# EasyEDA Pro project FOC第一版-DRV8301.epro

# Schematic Schematic1
Board Name: Board1; Create Date: 2025-05-15; Page Name: P1; Project Name: FOC三相-DRV8301; Schematic Name: Schematic1; Update Date: 2025-05-19; BladeWidth: 10; Company: 嘉立创EDA; Page Size: A3; RegionStart: 1; ShowBorder: 1; TitleBlock: 1; TitleBlockPosition: 3; Version: V1.0; XRegionCount: 6; YRegionCount: 4
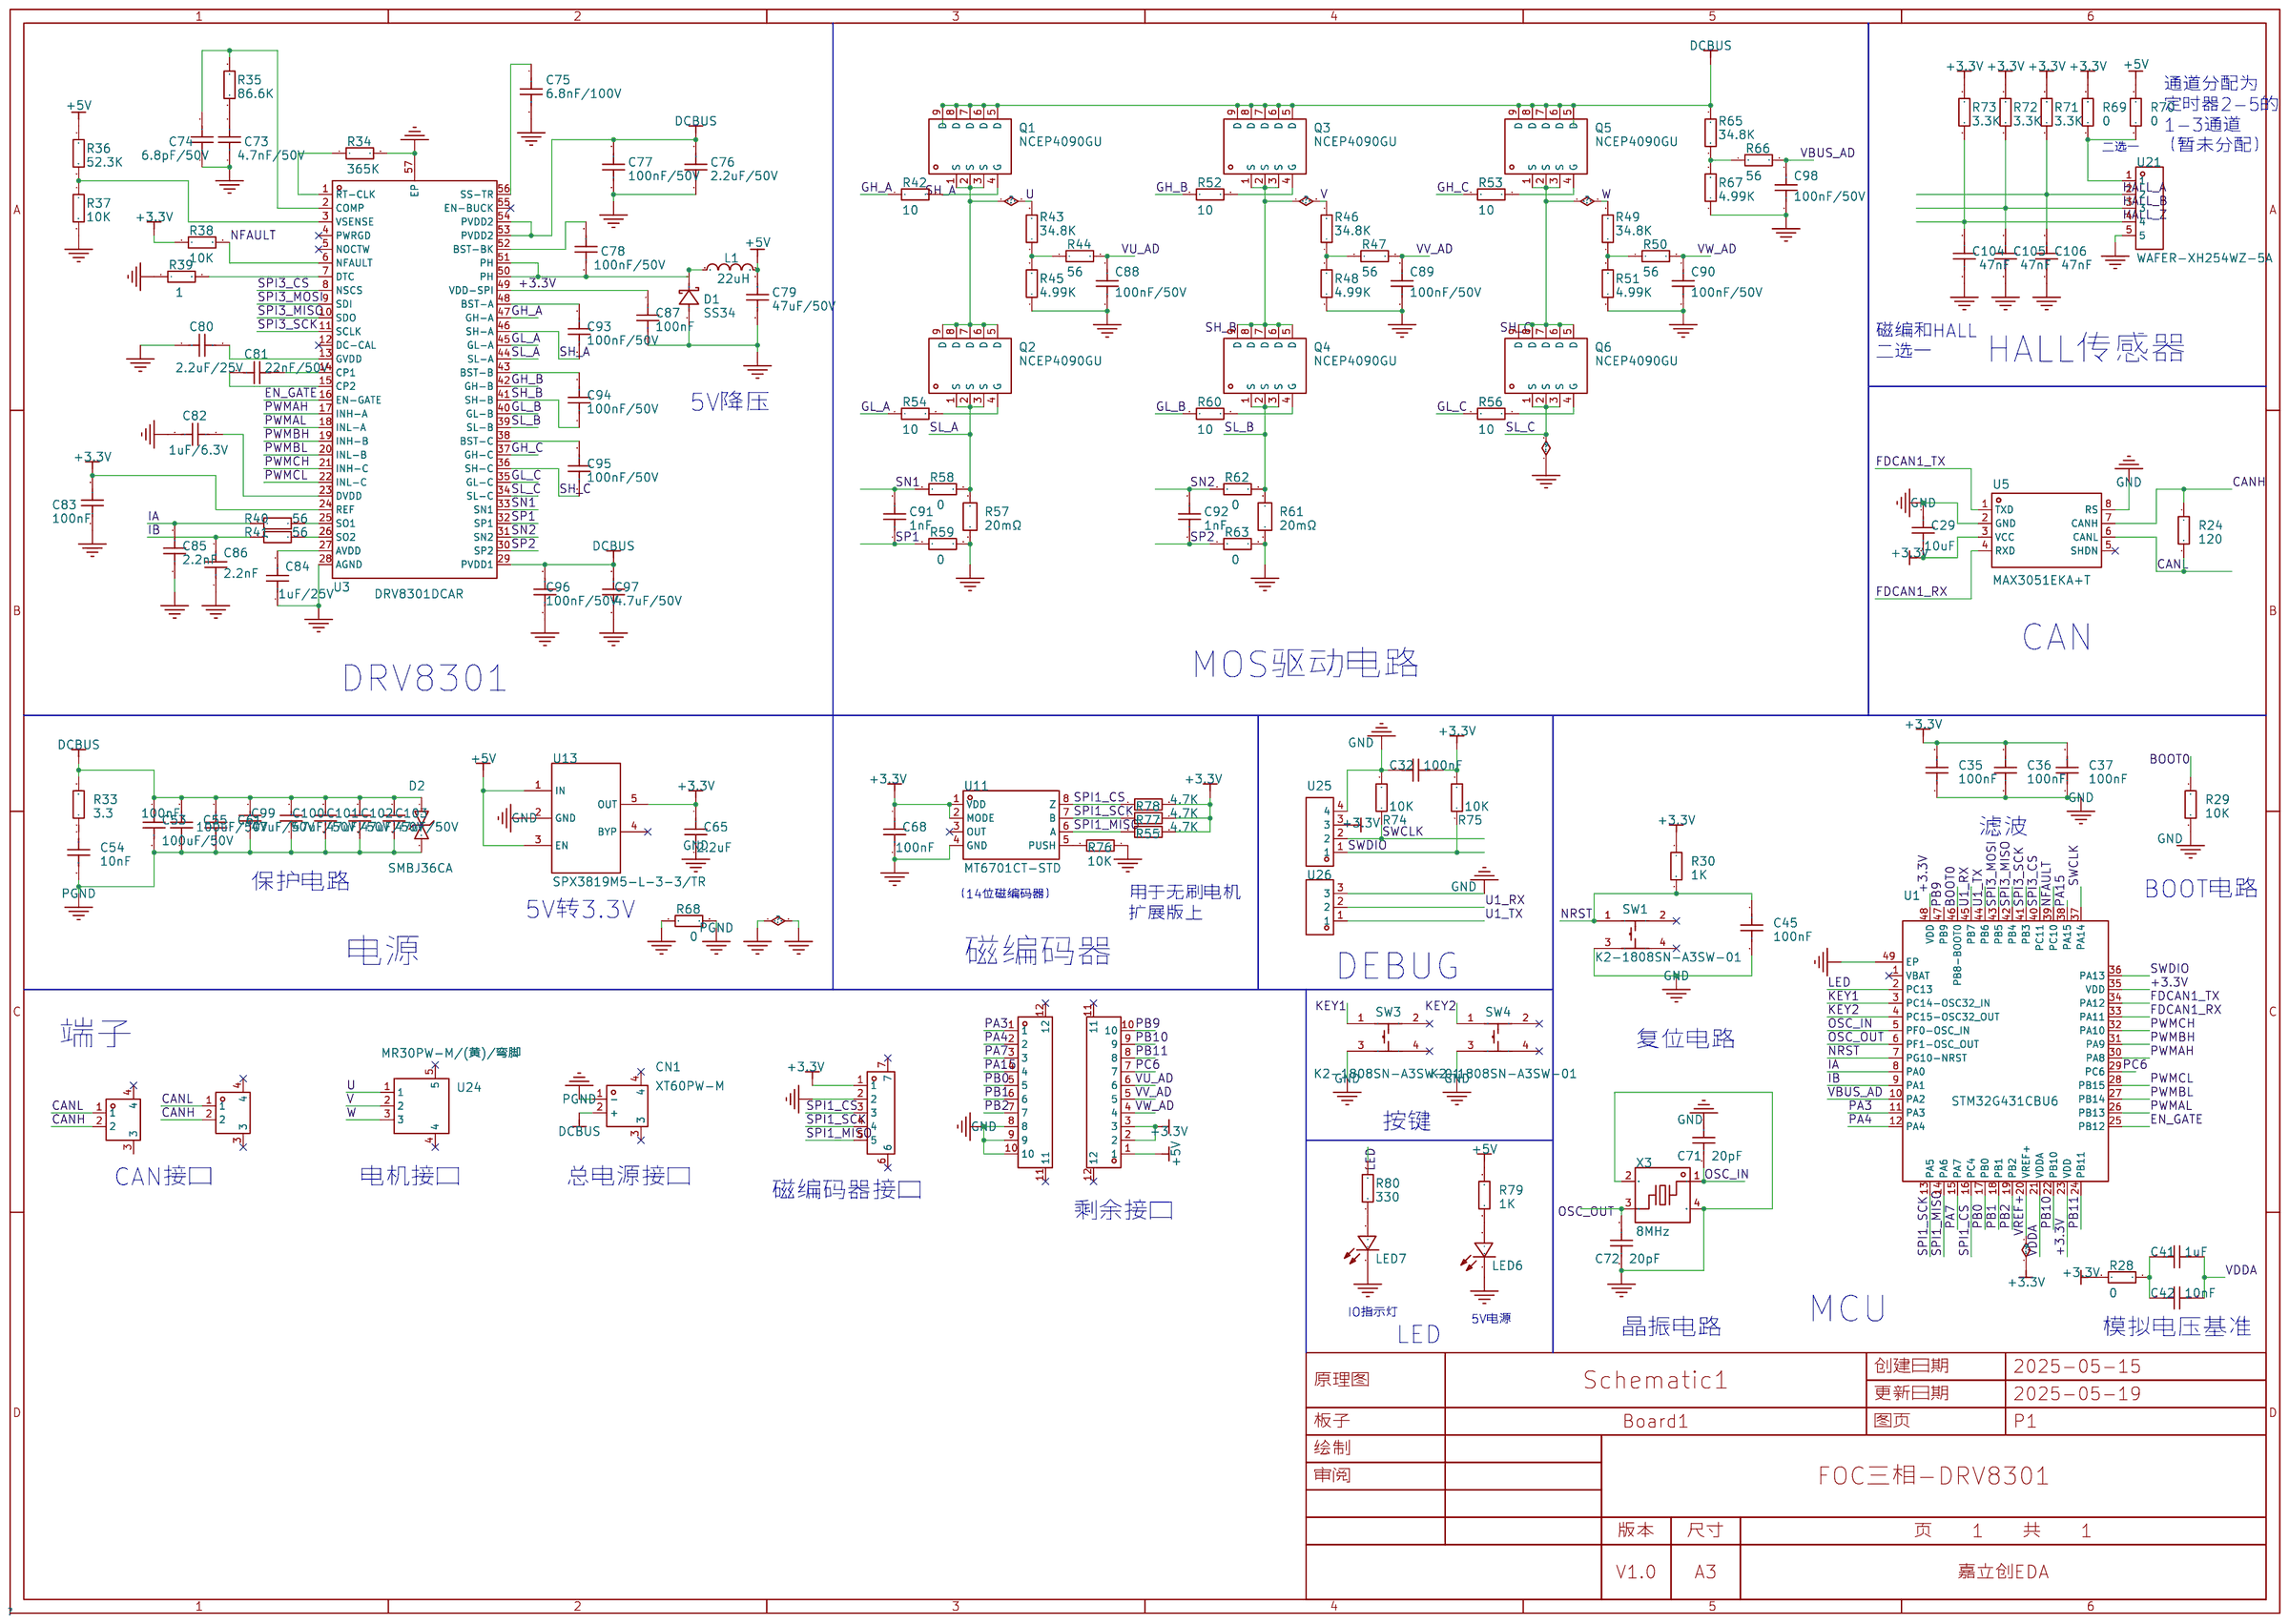
[diagram p0: schematic sheet]

## Parts
C29  10uF  [C0603]
C32  100nF  [C0603]
C35  100nF  [C0603]
C36  100nF  [C0603]
C37  100nF  [C0603]
C41  1uF  [C0603]
C42  10nF  [C0603]
C45  100nF  [C0603]
C53  100nF  [C0603]
C54  10nF  [C0603]
C55  100uF/50V  [C1206]
C61  100uF/50V  [C1206]
C65  2.2uF  [C0603]
C68  100nF  [C0603]
C71  20pF  [C0603]
C72  20pF  [C0603]
C73  4.7nF/50V  [C0603]
C74  6.8pF/50V  [C0603]
C75  6.8nF/100V  [C0603]
C76  2.2uF/50V  [C0603]
C77  100nF/50V  [C0603]
C78  100nF/50V  [C0603]
C79  47uF/50V  [C1812]
C80  2.2uF/25V  [C0603]
C81  22nF/50V  [C0603]
C82  1uF/6.3V  [C0603]
C83  100nF  [C0603]
C84  1uF/25V  [C0603]
C85  2.2nF  [C0603]
C86  2.2nF  [C0603]
C87  100nF  [C0603]
C88  100nF/50V  [C0603]
C89  100nF/50V  [C0603]
C90  100nF/50V  [C0603]
C91  1nF  [C0603]
C92  1nF  [C0603]
C93  100nF/50V  [C0603]
C94  100nF/50V  [C0603]
C95  100nF/50V  [C0603]
C96  100nF/50V  [C0603]
C97  4.7uF/50V  [C0603]
C98  100nF/50V  [C0603]
C99  47uF/50V  [C1812]
C100  47uF/50V  [C1812]
C101  47uF/50V  [C1812]
C102  47uF/50V  [C1812]
C103  47uF/50V  [C1812]
C104  47nF  [C0603]
C105  47nF  [C0603]
C106  47nF  [C0603]
CN1  XT60PW-M  [CONN-TH_XT60PW-M]
CN2  X9821WRS-02-9TSN  [CONN-SMD_2P-P1.25_X9821WRS-02-9TSN]
CN3  X9821WRS-02-9TSN  [CONN-SMD_2P-P1.25_X9821WRS-02-9TSN]
CN4  X9821WRS-05-9TSN  [CONN-SMD_5P-P1.25_X9821WRS-05-9TSN]
CN7  X9821WRS-10-9TSN  [CONN-SMD_10P-P1.25_X9821WRS-10-9TSN]
CN8  X9821WRS-10-9TSN  [CONN-SMD_10P-P1.25_X9821WRS-10-9TSN]
D1  SS34  [SMA_L4.3-W2.5-LS5.0-RD]
D2  SMBJ36CA  [SMB_L4.4-W3.6-LS5.3-BI]
L1  22uH  [IND-SMD_L7.0-W6.6_FXL0630]
LED6  KT-0603R  [LED0603-RD]
LED7  KT-0603R  [LED0603-RD]
Q1  NCEP4090GU  [PDFN-8_L5.8-W5.1-P1.27-LS6.1-BL]
Q2  NCEP4090GU  [PDFN-8_L5.8-W5.1-P1.27-LS6.1-BL]
Q3  NCEP4090GU  [PDFN-8_L5.8-W5.1-P1.27-LS6.1-BL]
Q4  NCEP4090GU  [PDFN-8_L5.8-W5.1-P1.27-LS6.1-BL]
Q5  NCEP4090GU  [PDFN-8_L5.8-W5.1-P1.27-LS6.1-BL]
Q6  NCEP4090GU  [PDFN-8_L5.8-W5.1-P1.27-LS6.1-BL]
R24  120  [R0603]
R28  0  [R0603]
R29  10K  [R0603]
R30  1K  [R0603]
R33  3.3  [R0603]
R34  365K  [R0603]
R35  86.6K  [R0603]
R36  52.3K  [R0603]
R37  10K  [R0603]
R38  10K  [R0603]
R39  1  [R0603]
R40  56  [R0603]
R41  56  [R0603]
R42  10  [R0603]
R43  34.8K  [R0603]
R44  56  [R0603]
R45  4.99K  [R0603]
R46  34.8K  [R0603]
R47  56  [R0603]
R48  4.99K  [R0603]
R49  34.8K  [R0603]
R50  56  [R0603]
R51  4.99K  [R0603]
R52  10  [R0603]
R53  10  [R0603]
R54  10  [R0603]
R55  4.7K  [R0603]
R56  10  [R0603]
R57  20mΩ  [RES-SMD_L6.4-W3.2-1]
R58  0  [R0603]
R59  0  [R0603]
R60  10  [R0603]
R61  20mΩ  [RES-SMD_L6.4-W3.2-1]
R62  0  [R0603]
R63  0  [R0603]
R65  34.8K  [R0603]
R66  56  [R0603]
R67  4.99K  [R0603]
R68  0  [R0603]
R69  0  [R0603]
R70  0  [R0603]
R71  3.3K  [R0603]
R72  3.3K  [R0603]
R73  3.3K  [R0603]
R74  10K  [R0603]
R75  10K  [R0603]
R76  10K  [R0603]
R77  4.7K  [R0603]
R78  4.7K  [R0603]
R79  1K  [R0603]
R80  330  [R0603]
SW1  K2-1808SN-A3SW-01  [SW-SMD_4P-L4.2-W3.3-P2.15-LS5.1]
SW3  K2-1808SN-A3SW-01  [SW-SMD_4P-L4.2-W3.3-P2.15-LS5.1]
SW4  K2-1808SN-A3SW-01  [SW-SMD_4P-L4.2-W3.3-P2.15-LS5.1]
U1  STM32G431CBU6  [VQFN-48_L7.0-W7.0-P0.50-BL-EP5.5]
U3  DRV8301DCAR  [HTSSOP-56_L14.0-W6.0-P0.50-LS8.0-BL]
U5  MAX3051EKA+T  [SOT-23-8_L3.0-W1.7-P0.65-LS2.8-TL]
U11  MT6701CT-STD  [SOP-8_L4.9-W3.9-P1.27-LS6.0-BL]
U13  SPX3819M5-L-3-3/TR  [SOT-23-5_L3.0-W1.7-P0.95-LS2.8-BL]
U21  WAFER-XH254WZ-5A  [CONN-TH_5P-P2.50_WAFER-XH254WZ-5A]
U24  MR30PW-M/(黄)/弯脚  [CONN-TH_MR30PW-M]
U25  WAFER-XH254WZ-4A  [CONN-TH_4P-P2.50_WAFER-XH254WZ-4A]
U26  WAFER-XH254WZ-3A  [CONN-TH_WAFER-XH254WZ-3A]
X3  8MHz  [CRYSTAL-SMD_4P-L3.2-W2.5-BL]

## Library data of the parts
C29 C32 C35-C37 C41 C42 C45 C53 C54 C65 C68 C71-C78 C80-C98 C104-C106 = CAP_0603: Supplier Footprint: 0603
C55 C61 C79 = CAP_1206: Supplier Footprint: 1206
C99-C103 = C4532X7R1E226MT000N: 容值:22uF;精度:±20%;额定电压:25V;温度系数:X7R;; LCSC Part Name: 22uF ±20% 25V; Supplier Part: C76690; Manufacturer: TDK; Supplier Footprint: 1812; JLCPCB Part Class: 扩展库; Datasheet: https://atta.szlcsc.com/upload/public/pdf/source/20191009/C435256_A698304126E0DD2EAD15F9D05758F127.pdf; Supplier: LCSC; Tolerance: ±20%; Voltage Rating: 25V; Temperature Coefficient: X7R
CN1 = XT60PW-M: 类别:-;类型1:-;; LCSC Part Name: AMASS(艾迈斯)航模插头xt60连接器150公母对接pw锂电池公头 板插卧式XT60PW-M; Supplier Part: C98732; Manufacturer: AMASS(艾迈斯); JLCPCB Part Class: 扩展库; Datasheet: https://atta.szlcsc.com/upload/public/pdf/source/20240118/44A3DCFF53BE25DC65378AFFB21277A4.pdf; Supplier: LCSC; Brand: 艾迈斯; Type: 卧式插头; Colour: 黄色; InterfaceType: 公头
CN2 CN3 = X9821WRS-02-9TSN: 插针结构:1x2P;间距:1.25mm;安装方式:卧贴;参考系列:-;总PIN数:2P;排数:1;每排PIN数:2;行距:-;额定电流:1A;触头材质:黄铜;触头镀层:锡;工作温度范围:-;; LCSC Part Name: 1x2P 间距:1.25mm 卧贴; Supplier Part: C397377; Manufacturer: XKB Connection(中国星坤); Supplier Footprint: SMD,P=1.25mm,卧贴; JLCPCB Part Class: 扩展库; Datasheet: https://atta.szlcsc.com/upload/public/pdf/source/20211009/8EC70A3756BF98D2018F34C331B3A406.pdf; Supplier: LCSC; Pins Structure: 1x2P; Pitch: 1.25mm; Mounting Style: 卧贴; Number of Pins: 2P; Number of Rows: 1; Number of PINs Per Row: 2; Current Rating (Max): 1A; Contact Material: 黄铜; Contact Plating: 锡
CN4 = X9821WRS-05-9TSN: 插针结构:1x5P;间距:1.25mm;安装方式:卧贴;参考系列:-;总PIN数:5P;排数:1;每排PIN数:5;行距:-;额定电流:1A;触头材质:黄铜;触头镀层:锡;工作温度范围:-;; LCSC Part Name: 1x5P 间距:1.25mm 卧贴; Supplier Part: C397380; Manufacturer: XKB Connection(中国星坤); Supplier Footprint: SMD,P=1.25mm,卧贴; JLCPCB Part Class: 扩展库; Datasheet: https://atta.szlcsc.com/upload/public/pdf/source/20211009/8EC70A3756BF98D2018F34C331B3A406.pdf; Supplier: LCSC; Pins Structure: 1x5P; Pitch: 1.25mm; Mounting Style: 卧贴; Number of Pins: 5P; Number of Rows: 1; Number of PINs Per Row: 5; Current Rating (Max): 1A; Contact Material: 黄铜; Contact Plating: 锡
CN7 CN8 = X9821WRS-10-9TSN: 插针结构:1x10P;间距:1.25mm;安装方式:卧贴;参考系列:-;总PIN数:10P;排数:1;每排PIN数:10;行距:-;额定电流:1A;触头材质:黄铜;触头镀层:锡;工作温度范围:-;; LCSC Part Name: 1x10P 间距:1.25mm 卧贴; Supplier Part: C397385; Manufacturer: XKB Connection(中国星坤); Supplier Footprint: SMD,P=1.25mm,卧贴; Datasheet: https://atta.szlcsc.com/upload/public/pdf/source/20211009/8EC70A3756BF98D2018F34C331B3A406.pdf; Supplier: LCSC; Pins Structure: 1x10P; Pitch: 1.25mm; Mounting Style: 卧贴; Number of Pins: 10P; Number of Rows: 1; Number of PINs Per Row: 10; Current Rating (Max): 1A; Contact Material: 黄铜; Contact Plating: 锡
D1 = SS34_C727060: 二极管配置:独立式;正向压降(Vf):550mV@3A;直流反向耐压(Vr):40V;整流电流:3A;; LCSC Part Name: 电压:40V 电流:3A; Supplier Part: C727060; Manufacturer: TWGMC(台湾迪嘉); Supplier Footprint: SMA(DO-214AC); JLCPCB Part Class: 扩展库; Datasheet: https://atta.szlcsc.com/upload/public/pdf/source/20200828/C727059_6599B6CAC5F3238B9C33E46794659DBE.pdf; Supplier: LCSC; Diode Configuration: 独立式; Forward Voltage (Vf@If): 550mV@3A; Reverse Voltage (Vr): 40V; Rectified Current: 3A; Reverse Leakage Current (Ir): 500uA; Average Rectified Current (Io): 3A
D2 = SMBJ36CA_C726875: 极性：双向 反向截止电压(Vrwm)：36V 击穿电压：40V 最大钳位电压：58.1V; Supplier Part: C726875; Manufacturer: TWGMC(台湾迪嘉); Supplier Footprint: SMB; JLCPCB Part Class: 扩展库; Datasheet: https://atta.szlcsc.com/upload/public/pdf/source/20200901/C726811_07201DC3516E92FF13903A0BAE18F725.pdf; Supplier: LCSC
L1 = FXL0630-220-M: 电感值:22uH;精度:±20%;额定电流:2.5A;类型:一体成型电感;饱和电流(Isat):3A;; LCSC Part Name: 22uH ±20% 3A; Supplier Part: C177244; Manufacturer: cjiang(长江微电); Supplier Footprint: SMD,6.6x7mm; JLCPCB Part Class: 扩展库; Datasheet: https://atta.szlcsc.com/upload/public/pdf/source/20230516/3A080F5AF8C87BB81C3BA86E5F60E51A.pdf; Supplier: LCSC; Tolerance: ±20%; Rated Current: 2.5A; Type: 一体成型电感; DC Resistance (DCR): 200mΩ; Saturation Current (Isat): 3A
LED6 LED7 = KT-0603R: 发光颜色:红色;功率:-;正向电流:-;主波长:-;二极管配置:-;透镜颜色:-;色温:-;发光角度:-;载带方式:-;工作温度:-40℃~+85℃;; LCSC Part Name: 0603 红灯 高亮; Supplier Part: C2286; Manufacturer: KENTO; Supplier Footprint: 0603; JLCPCB Part Class: 基础库; Datasheet: https://atta.szlcsc.com/upload/public/pdf/source/20160616/1466072038404.pdf; Supplier: LCSC; Emitted Color: 红色; Operating Temperature: -40℃~+85℃
Q1-Q6 = NCEP4090GU: 类型:1个N沟道;漏源电压(Vdss):40V;连续漏极电流(Id):90A;导通电阻(RDS(on)@Vgs,Id):2.2mΩ@10V,20A;功率:34W;阈值电压(Vgs(th)@Id):1.5V@250uA;; LCSC Part Name: 1个N沟道 耐压:40V 电流:90A; Supplier Part: C502976; Manufacturer: NCE(无锡新洁能); Supplier Footprint: PDFN-8(5.1x5.8); JLCPCB Part Class: 扩展库; Datasheet: https://atta.szlcsc.com/upload/public/pdf/source/20220527/503A5DACCB80AF3F7DC57D53F14F52A5.pdf; Supplier: LCSC; Type: 1个N沟道; Drain Source Voltage (Vdss): 40V; Continuous Drain Current (Id): 90A; Drain Source On Resistance (RDS(on)@Vgs,Id): 2.2mΩ@10V,20A; Power Dissipation (Pd): 34W; Gate Threshold Voltage (Vgs(th)@Id): 1.5V@250uA; Total Gate Charge (Qg@Vgs): 40nC@20V; Input Capacitance (Ciss@Vds): 2.3nF@20V; Reverse Transfer Capacitance (Crss@Vds): 38pF; Operating Temperature: -55℃~+150℃
R24 R28-R30 R33-R56 R58-R60 R62 R63 R65-R80 = Res_0603: Supplier Footprint: 0603
R57 R61 = LR2512D-3W-20mR-1%: 电阻类型:采样电阻;阻值:20mΩ;精度:±1%;功率:3W;温度系数:25ppm/℃~+50ppm/℃;安装方式:贴片;; LCSC Part Name: 20mΩ ±1% 3W; Supplier Part: C500741; Manufacturer: Milliohm(毫欧); Supplier Footprint: 2512; JLCPCB Part Class: 扩展库; Datasheet: https://atta.szlcsc.com/upload/public/pdf/source/20211008/27BCB003066C6550DC06C87D8395239C.pdf; Supplier: LCSC; Type: 采样电阻; Tolerance: ±1%; Power(Watts): 3W; Temperature Coefficient: 25ppm/℃~+50ppm/℃; Mounting Sytle: 贴片
SW1 SW3 SW4 = K2-1808SN-A3SW-01: 触点电流:50mA;额定电压(DC):12V;绝缘电阻:100MΩ;安装方式:立贴;作用力:180gf@±30gf;机械寿命:100000;工作温度:-25℃~+85℃;开关长度:4.2mm;开关宽度:3.25mm;开关高度:2.5mm;; LCSC Part Name: 3*4*2.5 贴片开关180G; Supplier Part: C2690012; Manufacturer: 韩国韩荣; Supplier Footprint: SMD; JLCPCB Part Class: 扩展库; Datasheet: https://atta.szlcsc.com/upload/public/pdf/source/20180927/C283535_7E7907F3E7B6C1691E1DC87E363D082A.pdf; Supplier: LCSC; Contact Current: 50mA; Voltage Rating (DC): 12V; Insulation Resistance: 100MΩ; Mounting Sytle: 立贴; Operating Force: 180gf@±30gf; Mechanical Life: 100000; Operating Temperature: -25℃~+85℃; Switch Length: 4.2mm; Switch Width: 3.25mm; Switch Height: 2.5mm
U1 = STM32G431CBU6: CPU内核:ARM-M系列;CPU最大主频:170MHz;应用领域:-;; LCSC Part Name: 带DSP和FPU的170MHz主流ARM Cortex-M4 MCU，具有128 KB Flash存储器、数学加速器和中等模拟电平集成; Supplier Part: C529356; Manufacturer: ST(意法半导体); Supplier Footprint: UFQFPN-48(7x7); JLCPCB Part Class: 扩展库; Datasheet: https://atta.szlcsc.com/upload/public/pdf/source/20200511/C529354_7C66CF00837B904D0C15DCE45B69418C.pdf; Supplier: LCSC; CPU Core: ARM-M系列; CPU Maximum Speed: 170MHz; Program Storage Size: 128KB; Program Memory Type: FLASH; Number of I/O: 42; ADC (Bit): 12bit; DAC (Bit): 12bit; Low Voltage Detection Threshold: 1.71V~3.6V
U3 = DRV8301DCAR: DRV8301 具有降压稳压器、电流分流放大器和 SPI 的最大 65V 三相栅极驱动器; LCSC Part Name: 无刷直流BLDC电机驱动芯片 60V; Supplier Part: C98969; Manufacturer: TI(德州仪器); Supplier Footprint: HTSSOP-56-6mm; JLCPCB Part Class: 扩展库; Datasheet: https://www.ti.com/cn/lit/gpn/drv8301; Supplier: LCSC; Interface: SPI; Operating Temperature: -40℃~+125℃
U5 = MAX3051EKA+T: 类型:收发器;数据速率:1Mbps;; LCSC Part Name: 1Mbps 3.14V~3.47V; Supplier Part: C112005; Manufacturer: ADI(亚德诺); Supplier Footprint: SOT-23-8; JLCPCB Part Class: 扩展库; Datasheet: https://atta.szlcsc.com/upload/public/pdf/source/20171014/C112005_15079752662991037925.pdf; Supplier: LCSC; Type: 收发器; Data Rate: 1Mbps; Supply Voltage: 3.14V~3.47V
U11 = MT6701CT-STD_C5451785: Supplier Part: C5451785; Manufacturer: MagnTek(麦歌恩); Supplier Footprint: SOP-8; JLCPCB Part Class: 扩展库; Datasheet: https://atta.szlcsc.com/upload/public/pdf/source/20240409/995E18415A669787D9A549675AADF1FD.pdf; Supplier: LCSC
U13 = SPX3819M5-L-3-3/TR: 输出类型:固定;最大输入电压:16V;输出电压:3.3V;最大输出电流:500mA;电源纹波抑制比(PSRR):70dB;输出极性:正极;; LCSC Part Name: 输入16V 输出3.3V 500mA; Supplier Part: C9055; Manufacturer: MaxLinear(迈凌); Supplier Footprint: SOT-23-5; JLCPCB Part Class: 扩展库; Datasheet: https://atta.szlcsc.com/upload/public/pdf/source/20150720/1457707331934.pdf; Supplier: LCSC; Output Type: 固定; Maximum Input Voltage: 16V; Output Voltage: 3.3V; MAX Output Current: 500mA; Power Supply Rejection Ratio (PSRR): 70dB; Dropout Voltage: 700mV@(500mA); standby current: 8uA; Operating Temperature: -40℃~+125℃; Output Polarity: 正极; Number of Outputs: 1
U21 = WAFER-XH254WZ-5A: 插针结构:1x5P;间距:2.54mm;安装方式:弯插;参考系列:XH;总PIN数:5P;排数:1;每排PIN数:5;额定电流:3A;触头材质:黄铜;工作温度:-25℃~+85℃;; LCSC Part Name: 1x5P 间距:2.54mm 弯插 系列:XH; Supplier Part: C7432694; Manufacturer: HANBO(汉博); Supplier Footprint: 插件,P=2.5mm; JLCPCB Part Class: 扩展库; Datasheet: https://atta.szlcsc.com/upload/public/pdf/source/20230721/127D646758C1D4B76FEF9901992220E1.pdf; Supplier: LCSC; Pins Structure: 1x5P; Pitch: 2.54mm; Mounting Type: 弯插; Reference Series: XH; Number of Pins: 5P; Number of Rows: 1; Number of PINs Per Row: 5; Current Rating: 3A; Contact Material: 黄铜; Operating Temperature: -25℃~+85℃; Voltage Rating: 250V; Plastic Material: PA66; Flame Retardant Rating: UL94V-0
U24 = MR30PW-M/(黄)/弯脚: Supplier Part: C9900011214; JLCPCB Part Class: 扩展库; Supplier: LCSC
U25 = WAFER-XH254WZ-4A: 插针结构:1x4P;间距:2.54mm;安装方式:弯插;参考系列:XH;总PIN数:4P;排数:1;每排PIN数:4;额定电流:3A;触头材质:黄铜;工作温度:-25℃~+85℃;; LCSC Part Name: 1x4P 间距:2.54mm 弯插 系列:XH; Supplier Part: C7432693; Manufacturer: HANBO(汉博); Supplier Footprint: 插件,P=2.5mm; Datasheet: https://atta.szlcsc.com/upload/public/pdf/source/20230721/127D646758C1D4B76FEF9901992220E1.pdf; Supplier: LCSC; Pins Structure: 1x4P; Pitch: 2.54mm; Mounting Type: 弯插; Reference Series: XH; Number of Pins: 4P; Number of Rows: 1; Number of PINs Per Row: 4; Current Rating: 3A; Contact Material: 黄铜; Operating Temperature: -25℃~+85℃; Voltage Rating: 250V; Plastic Material: PA66; Flame Retardant Rating: UL94V-0
U26 = WAFER-XH254WZ-3A: 插针结构:1x3P;间距:2.54mm;安装方式:弯插;参考系列:XH;总PIN数:3P;排数:1;每排PIN数:3;额定电流:3A;触头材质:黄铜;工作温度:-25℃~+85℃;; LCSC Part Name: 1x3P 间距:2.54mm 弯插 系列:XH; Supplier Part: C7432692; Manufacturer: HANBO(汉博); Supplier Footprint: 插件,P=2.5mm; JLCPCB Part Class: 扩展库; Datasheet: https://atta.szlcsc.com/upload/public/pdf/source/20230721/127D646758C1D4B76FEF9901992220E1.pdf; Supplier: LCSC; Pins Structure: 1x3P; Pitch: 2.54mm; Mounting Type: 弯插; Reference Series: XH; Number of Pins: 3P; Number of Rows: 1; Number of PINs Per Row: 3; Current Rating: 3A; Contact Material: 黄铜; Operating Temperature: -25℃~+85℃; Voltage Rating: 250V; Plastic Material: PA66; Flame Retardant Rating: UL94V-0
X3 = X32258MSB4SI: 晶振类型:贴片晶振;频率:8MHz;常温频差:±10ppm;外接负载电容:20pF;频率稳定度(全温):±20ppm;; LCSC Part Name: 8MHz ±10ppm 20pF; Supplier Part: C2682774; Manufacturer: YXC(扬兴晶振); Supplier Footprint: SMD3225-4P; JLCPCB Part Class: 扩展库; Datasheet: https://atta.szlcsc.com/upload/public/pdf/source/20240329/19D5F850207469550BEB00D7DFEDBC7A.pdf; Supplier: LCSC; Crystal Type: 贴片晶振; Normal temperature Frequency Tolerance: ±10ppm; External load capacitor: 20pF; Frequency Stability(Full temperature range): ±20ppm; Operating Temperature: -40℃~+85℃

## Nets
+3.3V: C29.2 C32.1 C35.2 C36.2 C37.2 C65.1 C68.1 C83.2 C87.1 CN4.1 CN8.2 CN8.3 R28.2 R30.1 R38.1 R55.2 R69.2 R71.2 R72.2 R73.2 R75.2 R77.2 R78.2 U1.20(VREF+) U1.23(VDD) U1.35(VDD) U1.48(VDD) U3.24(REF) U3.49(VDD-SPI) U5.3(VCC) U11.1(VDD) U11.2(MODE) U13.5(OUT) U25.3
+5V: C79.2 CN8.1 L1.2 R36.1 R70.2 R79.1 U13.1(IN) U13.3(EN)
AGND: C29.1 C32.2 C35.1 C36.1 C37.1 C45.2 C65.2 C68.2 C71.1 C72.1 C73.1 C74.1 C79.1 C80.1 C82.1 C83.1 C84.1 C85.1 C86.1 C87.2 C88.2 C89.2 C90.2 C98.2 C104.1 C105.1 C106.1 CN4.2 CN7.8 CN7.9 CN7.10 D1.2(A) LED6.1(K) LED7.1(K) R29.2 R34.2 R37.2 R39.1 R45.1 R48.1 R51.1 R67.1 R68.1 R74.2 R76.2 SW1.3 SW3.3 SW4.3 U1.49(EP) U3.28(AGND) U3.57(EP) U5.2(GND) U5.8(RS) U11.4(GND) U13.2(GND) U21.5 U25.4 U26.3 X3.2(GND) X3.4(GND)
PGND: C53.2 C54.2 C55.1 C61.1 C75.2 C76.1 C77.1 C96.1 C97.1 C99.1 C100.1 C101.1 C102.1 C103.1 CN1.1(-) D2.2 Q6.1(S) Q6.2(S) Q6.3(S) R57.1 R59.2 R61.1 R63.2 R68.2 U3.34(SL-C)
VBUS_AD: C98.1 R66.2 U1.10(PA2)
VDDA: C41.1 C42.1 U1.21(VDDA)
BOOT0: R29.1 U1.46(PB8-BOOT0)
CANH: CN2.2 CN3.2 R24.1 U5.7(CANH)
CANL: CN2.1 CN3.1 R24.2 U5.6(CANL)
DCBUS: C53.1 C55.2 C61.2 C76.2 C77.2 C96.2 C97.2 C99.2 C100.2 C101.2 C102.2 C103.2 CN1.2(+) D2.1 Q1.5(D) Q1.6(D) Q1.7(D) Q1.8(D) Q1.9(D) Q3.5(D) Q3.6(D) Q3.7(D) Q3.8(D) Q3.9(D) Q5.5(D) Q5.6(D) Q5.7(D) Q5.8(D) Q5.9(D) R33.2 R65.2 U3.29(PVDD1) U3.53(PVDD2) U3.54(PVDD2)
EN_GATE: U1.25(PB12) U3.16(EN-GATE)
FDCAN1_RX: U1.33(PA11) U5.4(RXD)
FDCAN1_TX: U1.34(PA12) U5.1(TXD)
GH_A: R42.1 U3.47(GH-A)
GH_B: R52.1 U3.42(GH-B)
GH_C: R53.1 U3.37(GH-C)
GL_A: R54.1 U3.45(GL-A)
GL_B: R60.1 U3.40(GL-B)
GL_C: R56.1 U3.35(GL-C)
HALL_A: C106.2 R71.1 U21.2
HALL_B: C105.2 R72.1 U21.3
HALL_Z: C104.2 R73.1 U21.4
IA: C85.2 R40.1 U1.8(PA0)
IB: C86.2 R41.1 U1.9(PA1)
KEY1: SW3.1 U1.3(PC14-OSC32_IN)
KEY2: SW4.1 U1.4(PC15-OSC32_OUT)
LED: R80.1 U1.2(PC13)
NFAULT: R38.2 U1.39(PC10) U3.6(NFAULT)
NRST: C45.1 R30.2 SW1.1 U1.7(PG10-NRST)
OSC_IN: C71.2 U1.5(PF0-OSC_IN) X3.1
OSC_OUT: C72.2 U1.6(PF1-OSC_OUT) X3.3
PA3: CN7.1 U1.11(PA3)
PA4: CN7.2 U1.12(PA4)
PA7: CN7.3 U1.15(PA7)
PA15: CN7.4 U1.38(PA15)
PB0: CN7.5 U1.17(PB0)
PB1: CN7.6 U1.18(PB1)
PB2: CN7.7 U1.19(PB2)
PB9: CN8.10 U1.47(PB9)
PB10: CN8.9 U1.22(PB10)
PB11: CN8.8 U1.24(PB11)
PC6: CN8.7 U1.29(PC6)
PWMAH: U1.30(PA8) U3.17(INH-A)
PWMAL: U1.26(PB13) U3.18(INL-A)
PWMBH: U1.31(PA9) U3.19(INH-B)
PWMBL: U1.27(PB14) U3.20(INL-B)
PWMCH: U1.32(PA10) U3.21(INH-C)
PWMCL: U1.28(PB15) U3.22(INL-C)
SH_A: C93.1 Q1.1(S) Q1.2(S) Q1.3(S) Q2.5(D) Q2.6(D) Q2.7(D) Q2.8(D) Q2.9(D) R43.2 U3.46(SH-A) U24.1
SH_B: C94.1 Q3.1(S) Q3.2(S) Q3.3(S) Q4.5(D) Q4.6(D) Q4.7(D) Q4.8(D) Q4.9(D) R46.2 U3.41(SH-B) U24.2
SH_C: C95.1 Q5.1(S) Q5.2(S) Q5.3(S) Q6.5(D) Q6.6(D) Q6.7(D) Q6.8(D) Q6.9(D) R49.2 U3.36(SH-C) U24.3
SL_A: Q2.1(S) Q2.2(S) Q2.3(S) R57.2 R58.2 U3.44(SL-A)
SL_B: Q4.1(S) Q4.2(S) Q4.3(S) R61.2 R62.2 U3.39(SL-B)
SN1: C91.2 R58.1 U3.33(SN1)
SN2: C92.2 R62.1 U3.31(SN2)
SP1: C91.1 R59.1 U3.32(SP1)
SP2: C92.1 R63.1 U3.30(SP2)
SPI1_CS: CN4.3 R78.1 U1.16(PC4) U11.8(Z)
SPI1_MISO: CN4.5 R55.1 U1.14(PA6) U11.6(A)
SPI1_SCK: CN4.4 R77.1 U1.13(PA5) U11.7(B)
SPI3_CS: U1.40(PC11) U3.8(NSCS)
SPI3_MISO: U1.42(PB4) U3.10(SDO)
SPI3_MOSI: U1.43(PB5) U3.9(SDI)
SPI3_SCK: U1.41(PB3) U3.11(SCLK)
SWCLK: R74.1 U1.37(PA14) U25.2
SWDIO: R75.1 U1.36(PA13) U25.1
U1_RX: U1.45(PB7) U26.2
U1_TX: U1.44(PB6) U26.1
VU_AD: C88.1 CN8.6 R44.2
VV_AD: C89.1 CN8.5 R47.2
VW_AD: C90.1 CN8.4 R50.2
Net-(C41-2): C41.2 C42.2 R28.1
Net-(C54-1): C54.1 R33.1
Net-(C73-2): C73.2 R35.1
Net-(C74-2): C74.2 R35.2 U3.2(COMP)
Net-(C75-1): C75.1 U3.56(SS-TR)
Net-(C78-1): C78.1 D1.1(C) L1.1 U3.50(PH) U3.51(PH)
Net-(C78-2): C78.2 U3.52(BST-BK)
Net-(C80-2): C80.2 U3.13(GVDD)
Net-(C81-1): C81.1 U3.15(CP2)
Net-(C81-2): C81.2 U3.14(CP1)
Net-(C82-2): C82.2 U3.23(DVDD)
Net-(C84-2): C84.2 U3.27(AVDD)
Net-(C93-2): C93.2 U3.48(BST-A)
Net-(C94-2): C94.2 U3.43(BST-B)
Net-(C95-2): C95.2 U3.38(BST-C)
Net-(LED6-2): LED6.2(A) R79.2
Net-(LED7-2): LED7.2(A) R80.2
Net-(Q1-4): Q1.4(G) R42.2
Net-(Q2-4): Q2.4(G) R54.2
Net-(Q3-4): Q3.4(G) R52.2
Net-(Q4-4): Q4.4(G) R60.2
Net-(Q5-4): Q5.4(G) R53.2
Net-(Q6-4): Q6.4(G) R56.2
Net-(R34-1): R34.1 U3.1(RT-CLK)
Net-(R36-2): R36.2 R37.1 U3.3(VSENSE)
Net-(R39-2): R39.2 U3.7(DTC)
Net-(R40-2): R40.2 U3.25(SO1)
Net-(R41-2): R41.2 U3.26(SO2)
Net-(R43-1): R43.1 R44.1 R45.2
Net-(R46-1): R46.1 R47.1 R48.2
Net-(R49-1): R49.1 R50.1 R51.2
Net-(R65-1): R65.1 R66.1 R67.2
Net-(R69-1): R69.1 R70.1 U21.1
Net-(R76-1): R76.1 U11.5(PUSH)

Not connected (* = marked no-connect by the designer): CN1 3* 4*; CN2 3 4*; CN3 3* 4*; CN4 6* 7*; CN7 11* 12*; CN8 11* 12*; SW1 2* 4*; SW3 2* 4*; SW4 2* 4*; U1 1(VBAT)*; U3 4(PWRGD)* 5(NOCTW)* 12(DC-CAL)* 55(EN-BUCK)*; U5 5(SHDN)*; U11 3(OUT)*; U13 4(BYP)*; U24 4* 5*

## Notes on the sheet
- 通道分配为
  定时器2-5的
  1-3通道
  （暂未分配）
- 二选一
- 磁编和HALL
  二选一
- HALL传感器
- 5V降压
- CAN
- MOS驱动电路
- DRV8301
- 滤波
- 用于无刷电机
  扩展版上
- 保护电路
- （14位磁编码器）
- BOOT电路
- 5V转3.3V
- 电源
- 磁编码器
- DEBUG
- 端子
- 复位电路
- 按键
- CAN接口
- 电机接口
- 总电源接口
- 磁编码器接口
- 剩余接口
- IO指示灯
- 5V电源
- MCU
- 晶振电路
- 模拟电压基准
- LED
